# Altium schematic sheet yard-ice-fpga.SchDoc: Yard-Ice-FPGA
size 365 x 274 mm; Revision: 1.0; SheetNumber: 4; SheetTotal: 5
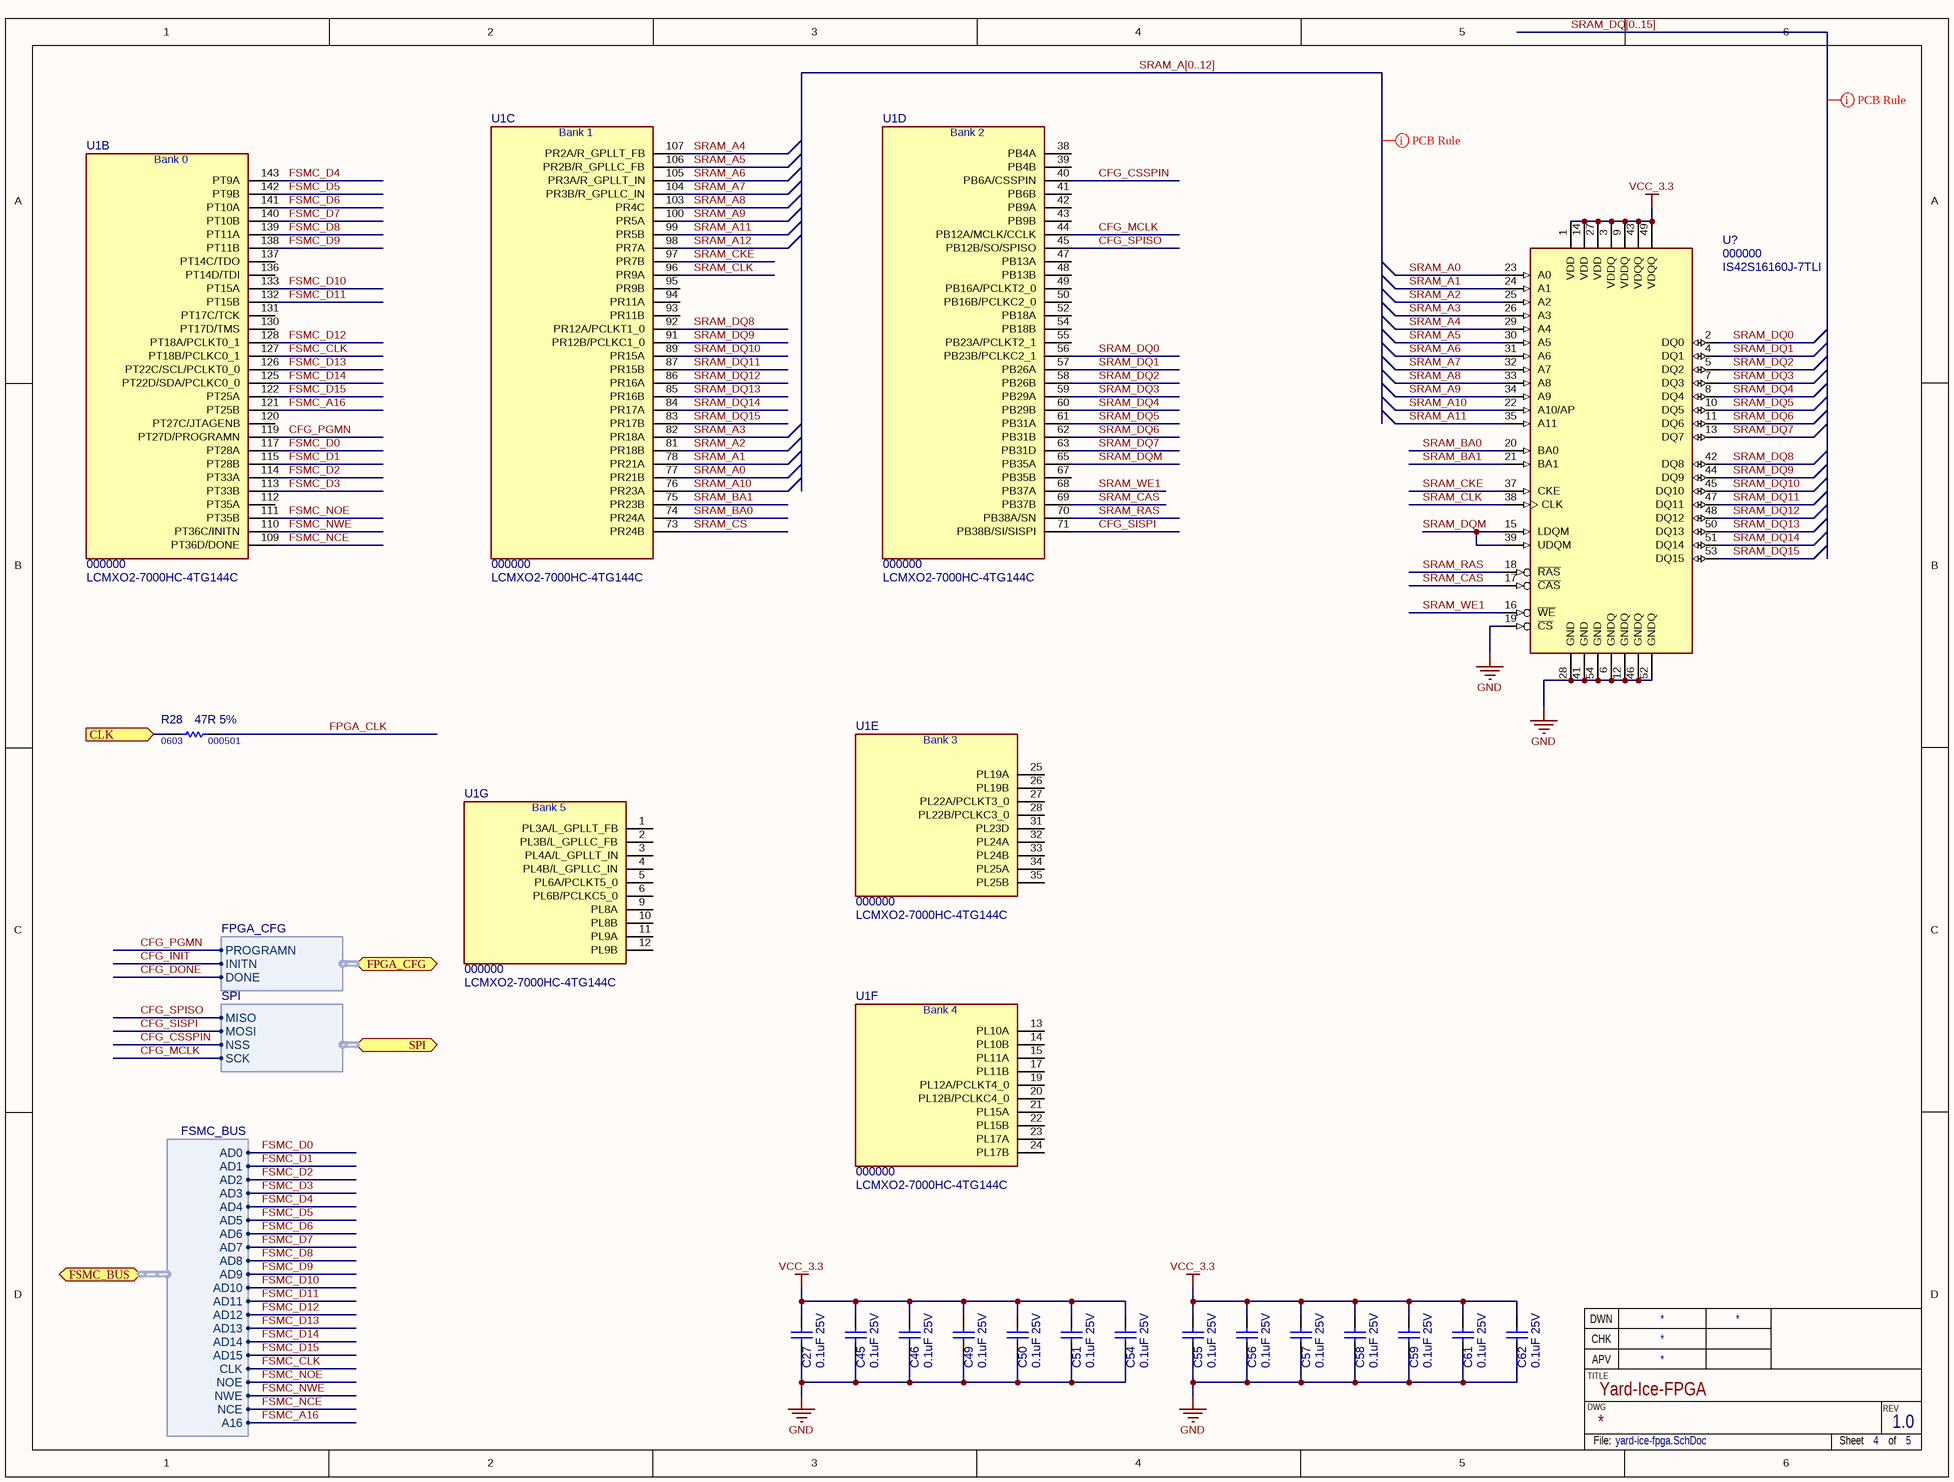
[diagram p0: yard-ice-fpga.SchDoc]

## Parts
C27  value 0.1uF 25V  [C0603M]  (hidden comment: 000500)
C45  value 0.1uF 25V  [C0603M]  (hidden comment: 000500)
C46  value 0.1uF 25V  [C0603M]  (hidden comment: 000500)
C49  value 0.1uF 25V  [C0603M]  (hidden comment: 000500)
C50  value 0.1uF 25V  [C0603M]  (hidden comment: 000500)
C51  value 0.1uF 25V  [C0603M]  (hidden comment: 000500)
C54  value 0.1uF 25V  [C0603M]  (hidden comment: 000500)
C55  value 0.1uF 25V  [C0603M]  (hidden comment: 000500)
C56  value 0.1uF 25V  [C0603M]  (hidden comment: 000500)
C57  value 0.1uF 25V  [C0603M]  (hidden comment: 000500)
C58  value 0.1uF 25V  [C0603M]  (hidden comment: 000500)
C59  value 0.1uF 25V  [C0603M]  (hidden comment: 000500)
C61  value 0.1uF 25V  [C0603M]  (hidden comment: 000500)
C62  value 0.1uF 25V  [C0603M]  (hidden comment: 000500)
R28  000501  value 47R 5%  Package: 0603  [R0603M]
U1  000000  value LCMXO2-7000HC-4TG144C  [144-TQFP]  (parts B,C,D,E,F,G of 7)
U?  000000  value IS42S16160J-7TLI  [TSOP-54-II]

## Ports
CLK (in), FPGA_CFG (harness FPGA_CFG), FSMC_BUS (harness FSMC_BUS), SPI (harness SPI)

## Harnesses
FSMC_BUS: AD0, AD1, AD2, AD3, AD4, AD5, AD6, AD7, AD8, AD9, AD10, AD11, AD12, AD13, AD14, AD15, CLK, NOE, NWE, NCE, A16
FPGA_CFG: DONE, INITN, PROGRAMN
SPI: NSS, MOSI, MISO, SCK

## Nets
GND: C27.2 C45.2 C46.2 C49.2 C50.2 C51.2 C54.2 C55.2 C56.2 C57.2 C58.2 C59.2 C61.2 C62.2 U?.6(GNDQ) U?.12(GNDQ) U?.19(~{CS}) U?.28(GND) U?.41(GND) U?.46(GNDQ) U?.52(GNDQ) U?.54(GND)
VCC_3.3: C27.1 C45.1 C46.1 C49.1 C50.1 C51.1 C54.1 C55.1 C56.1 C57.1 C58.1 C59.1 C61.1 C62.1 U?.1(VDD) U?.3(VDDQ) U?.9(VDDQ) U?.14(VDD) U?.27(VDD) U?.43(VDQQ) U?.49(VDQQ)
CFG_CSSPIN: U1.40(PB6A/CSSPIN) ; port SPI.NSS
CFG_DONE: port FPGA_CFG.DONE
CFG_INIT: port FPGA_CFG.INITN
CFG_MCLK: U1.44(PB12A/MCLK/CCLK) ; port SPI.SCK
CFG_PGMN: U1.119(PT27D/PROGRAMN) ; port FPGA_CFG.PROGRAMN
CFG_SISPI: U1.71(PB38B/SI/SISPI) ; port SPI.MOSI
CFG_SPISO: U1.45(PB12B/SO/SPISO) ; port SPI.MISO
CLK: R28.2 ; port CLK
FPGA_CLK: R28.1
FSMC_A16: U1.121(PT25B) ; port FSMC_BUS.A16
FSMC_CLK: U1.127(PT18B/PCLKC0_1) ; port FSMC_BUS.CLK
FSMC_D0: U1.117(PT28A) ; port FSMC_BUS.AD0
FSMC_D1: U1.115(PT28B) ; port FSMC_BUS.AD1
FSMC_D2: U1.114(PT33A) ; port FSMC_BUS.AD2
FSMC_D3: U1.113(PT33B) ; port FSMC_BUS.AD3
FSMC_D4: U1.143(PT9A) ; port FSMC_BUS.AD4
FSMC_D5: U1.142(PT9B) ; port FSMC_BUS.AD5
FSMC_D6: U1.141(PT10A) ; port FSMC_BUS.AD6
FSMC_D7: U1.140(PT10B) ; port FSMC_BUS.AD7
FSMC_D8: U1.139(PT11A) ; port FSMC_BUS.AD8
FSMC_D9: U1.138(PT11B) ; port FSMC_BUS.AD9
FSMC_D10: U1.133(PT15A) ; port FSMC_BUS.AD10
FSMC_D11: U1.132(PT15B) ; port FSMC_BUS.AD11
FSMC_D12: U1.128(PT18A/PCLKT0_1) ; port FSMC_BUS.AD12
FSMC_D13: U1.126(PT22C/SCL/PCLKT0_0) ; port FSMC_BUS.AD13
FSMC_D14: U1.125(PT22D/SDA/PCLKC0_0) ; port FSMC_BUS.AD14
FSMC_D15: U1.122(PT25A) ; port FSMC_BUS.AD15
FSMC_NCE: U1.109(PT36D/DONE) ; port FSMC_BUS.NCE
FSMC_NOE: U1.111(PT35B) ; port FSMC_BUS.NOE
FSMC_NWE: U1.110(PT36C/INITN) ; port FSMC_BUS.NWE
SRAM_A0: U1.77(PR21B) U?.23(A0)
SRAM_A1: U1.78(PR21A) U?.24(A1)
SRAM_A2: U1.81(PR18B) U?.25(A2)
SRAM_A3: U1.82(PR18A) U?.26(A3)
SRAM_A4: U1.107(PR2A/R_GPLLT_FB) U?.29(A4)
SRAM_A5: U1.106(PR2B/R_GPLLC_FB) U?.30(A5)
SRAM_A6: U1.105(PR3A/R_GPLLT_IN) U?.31(A6)
SRAM_A7: U1.104(PR3B/R_GPLLC_IN) U?.32(A7)
SRAM_A8: U1.103(PR4C) U?.33(A8)
SRAM_A9: U1.100(PR5A) U?.34(A9)
SRAM_A10: U1.76(PR23A) U?.22(A10/AP)
SRAM_A11: U1.99(PR5B) U?.35(A11)
SRAM_A12: U1.98(PR7A)
SRAM_BA0: U1.74(PR24A) U?.20(BA0)
SRAM_BA1: U1.75(PR23B) U?.21(BA1)
SRAM_CAS: U1.69(PB37B) U?.17(~{CAS})
SRAM_CKE: U1.97(PR7B) U?.37(CKE)
SRAM_CLK: U1.96(PR9A) U?.38(CLK)
SRAM_CS: U1.73(PR24B)
SRAM_DQ0: U1.56(PB23B/PCLKC2_1) U?.2(DQ0)
SRAM_DQ1: U1.57(PB26A) U?.4(DQ1)
SRAM_DQ2: U1.58(PB26B) U?.5(DQ2)
SRAM_DQ3: U1.59(PB29A) U?.7(DQ3)
SRAM_DQ4: U1.60(PB29B) U?.8(DQ4)
SRAM_DQ5: U1.61(PB31A) U?.10(DQ5)
SRAM_DQ6: U1.62(PB31B) U?.11(DQ6)
SRAM_DQ7: U1.63(PB31D) U?.13(DQ7)
SRAM_DQ8: U1.92(PR12A/PCLKT1_0) U?.42(DQ8)
SRAM_DQ9: U1.91(PR12B/PCLKC1_0) U?.44(DQ9)
SRAM_DQ10: U1.89(PR15A) U?.45(DQ10)
SRAM_DQ11: U1.87(PR15B) U?.47(DQ11)
SRAM_DQ12: U1.86(PR16A) U?.48(DQ12)
SRAM_DQ13: U1.85(PR16B) U?.50(DQ13)
SRAM_DQ14: U1.84(PR17A) U?.51(DQ14)
SRAM_DQ15: U1.83(PR17B) U?.53(DQ15)
SRAM_DQM: U1.65(PB35A) U?.15(LDQM) U?.39(UDQM)
SRAM_RAS: U1.70(PB38A/SN) U?.18(~{RAS})
SRAM_WE1: U1.68(PB37A) U?.16(~{WE})

Not connected (* = marked no-connect by the designer): U1 1(PL3A/L_GPLLT_FB) 2(PL3B/L_GPLLC_FB) 3(PL4A/L_GPLLT_IN) 4(PL4B/L_GPLLC_IN) 5(PL6A/PCLKT5_0) 6(PL6B/PCLKC5_0) 9(PL8A) 10(PL8B) 11(PL9A) 12(PL9B) 13(PL10A) 14(PL10B) 15(PL11A) 17(PL11B) 19(PL12A/PCLKT4_0) 20(PL12B/PCLKC4_0) 21(PL15A) 22(PL15B) 23(PL17A) 24(PL17B) 25(PL19A) 26(PL19B) 27(PL22A/PCLKT3_0) 28(PL22B/PCLKC3_0) 31(PL23D) 32(PL24A) 33(PL24B) 34(PL25A) 35(PL25B) 38(PB4A) 39(PB4B) 41(PB6B) 42(PB9A) 43(PB9B) 47(PB13A) 48(PB13B) 49(PB16A/PCLKT2_0) 50(PB16B/PCLKC2_0) 52(PB18A) 54(PB18B) 55(PB23A/PCLKT2_1) 67(PB35B) 93(PR11B) 94(PR11A) 95(PR9B) 112(PT35A) 120(PT27C/JTAGENB) 130(PT17D/TMS) 131(PT17C/TCK) 136(PT14D/TDI) 137(PT14C/TDO)

## Buses and harness runs
bus SRAM_A[0..12]
bus SRAM_DQ[0..15]

## Layout directives
rule Matched Net Lengths [Tolerance = 10mm]: (no net found under the mark)

## Notes on the sheet
- TITLE
- CHK
- DWN
- APV
- DWG
- REV
- File:
- Sheet
- of
- (in symbol LCMXO2-7000HC, part B) Bank 0
- (in symbol LCMXO2-7000HC, part C) Bank 1
- (in symbol LCMXO2-7000HC, part D) Bank 2
- (in symbol LCMXO2-7000HC, part E) Bank 3
- (in symbol LCMXO2-7000HC, part F) Bank 4
- (in symbol LCMXO2-7000HC, part G) Bank 5

## Library data of the parts
C27 C45 C46 C49-C51 C54-C59 C61 C62 = C0603: SMD Ceramic Chip Capacitor - 0603 - X7R; MF PN: C1608X7R1E104K; MF: TDK; PN: 000500; Package: 0603
R28 = R0603: SMD Chip Resistor - 0603; PN: 000501
U1 = LCMXO2-7000HC: FPGA, 6864 Logic Elements, Flash; MF: Lattice; Digy-Key PN: 220-1567-ND; PN: 000000; Package: 144-LQFP; ExtraInfo: *; MF PN: LCMXO2-7000HC-4TG144C
U? = IS42S16160J-7TL: 256Mbit (16M x16) 143MHz SDRAM; MF: ISSI; PN: 000000; Package: 54-TSOP II; ExtraInfo: *